# EasyEDA Pro project ProPrj_智能车主控V5.0-20251108_2026-08-26.epro, board PCB1
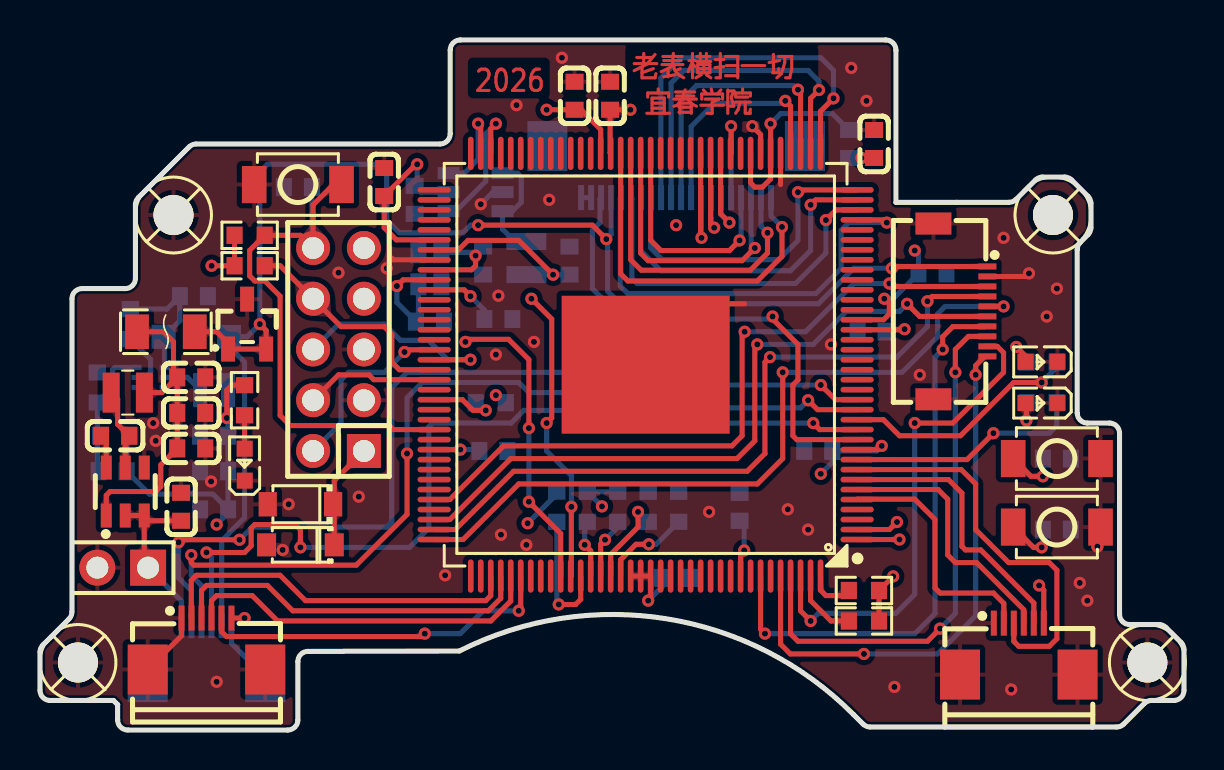
[diagram p13: board, top side]
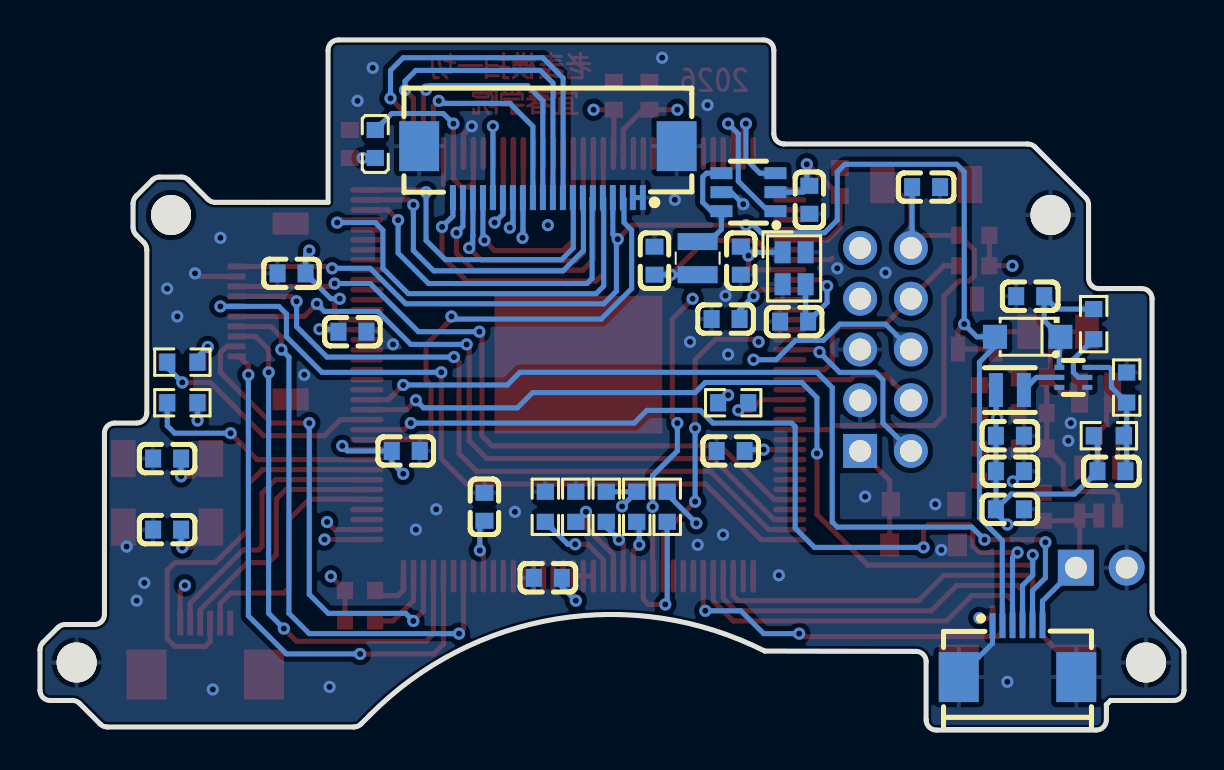
[diagram p14: board, bottom side, seen from below]

Outline 57.24 x 34.54 mm; copper layers: Top Layer, Inner1, Inner2, Bottom Layer. Coordinates in mm from the lower left corner of the outline.
Outline path: 0,3.9 arc(0.04,4.09) 0.15,4.26 1.45,5.56 arc(1.56,5.72) 1.6,5.92 1.6,21.59 arc(1.75,21.95) 2.11,22.1 4.27,22.1 arc(4.63,22.25) 4.78,22.61 4.78,26.29 arc(4.81,26.49) 4.92,26.65 7.46,29.19 arc(7.62,29.3) 7.82,29.34 20.02,29.34 arc(20.37,29.49) 20.52,29.84 20.52,34.04 arc(20.67,34.4) 21.03,34.54 42.32,34.54 arc(42.67,34.4) 42.82,34.04 42.82,26.42 48.48,26.42 arc(48.67,26.45) 48.84,26.57 49.8,27.53 arc(49.97,27.64) 50.16,27.68 51.26,27.68 arc(51.45,27.64) 51.62,27.53 52.43,26.72 arc(52.54,26.55) 52.58,26.36 52.58,25.16 arc(52.54,24.96) 52.43,24.8 52.04,24.41 arc(51.93,24.24) 51.89,24.05 51.89,15.88 arc(52.04,15.52) 52.4,15.37 53.5,15.37 arc(53.86,15.22) 54.01,14.86 54.01,5.79 arc(54.16,5.43) 54.52,5.28 55.98,5.28 arc(56.17,5.24) 56.34,5.13 57.09,4.38 arc(57.2,4.22) 57.24,4.02 57.24,1.99 arc(57.09,1.63) 56.73,1.48 55.61,1.48 arc(55.42,1.44) 55.25,1.33 54.22,0.3 arc(54.06,0.19) 53.86,0.15 41.54,0.15 arc(41.34,0.19) 41.18,0.3 40.72,0.76 arc(31.37,5.57) 20.98,3.95 13.41,3.94 arc(13.05,3.79) 12.9,3.43 12.9,0.51 arc(12.75,0.15) 12.4,0 4.39,0 arc(4.03,0.15) 3.89,0.51 3.89,1.27 3.68,1.48 0.51,1.48 arc(0.15,1.63) 0,1.99 0,3.9
Stack: Top Layer 0.035mm Outer layer thickness 1oz / Dielectric1 0.2104mm 7628 RC49% 8.6mil / Inner1 0.0152mm Inner layer thickness / Dielectric2 1.065mm 1.1mm H/HOZ Copper / Inner2 0.0152mm Inner layer thickness / Dielectric3 0.2104mm 7628 RC49% 8.6mil / Bottom Layer 0.035mm Outer layer thickness 1oz

## Design rules (mm)
spacing copperThickness1oz (default): track to track 0.102, other pairs 0.152 to 0.3
spacing copperThickness2oz: track to track 0.203, other pairs 0.152 to 0.3
track width copperThickness1oz (default): min 0.127, default 0.254, max 2.54
track width copperThickness2oz: min 0.203, default 0.254, max 2.54
differential pair differentialPair (default): width min 0.127, default 0.254, max 2.54; gap min 0.152, default 0.152
net VCC_3V3 uses copperRegion
net GND uses copperRegion

## Placement (name value [footprint] x y rotation side)
C1  10uF  [C0603]  7.06 11.18 270 top
C2  100nF  [C0603]  3.76 14.73 0 top
C3  100nF  [C0603]  7.57 17.65 180 top
C4  22uF  [C0603]  7.57 15.88 180 top
C5  22uF  [C0603]  7.57 14.1 180 top
C6  10uF  [C0603]  7.7 21.72 0 bottom
C7  22uF  [C0603]  8.71 14.73 0 bottom
C8  22uF  [C0603]  8.71 12.95 0 bottom
C9  100nF  [C0603]  8.71 11.05 0 bottom
C10  20pF  [C0603]  3.63 12.95 0 bottom
C11  22uF  [C0603]  18.75 26.54 90 bottom
C12  22uF  [C0603]  26.49 23.5 270 bottom
C13  12pF  [C0603]  22.17 23.5 90 bottom
C14  12pF  [C0603]  19.51 20.45 0 bottom
C15  100nF  [C0603]  12.9 27.18 0 bottom
C16  100nF  [C0603]  41.61 19.94 180 bottom
C17  100nF  [C0603]  38.94 13.97 180 bottom
C18  100nF  [C0603]  22.68 13.97 0 bottom
C19  100nF  [C0603]  28.52 31.75 90 top
C20  100nF  [C0603]  22.94 20.57 0 bottom
C21  100nF  [C0603]  17.22 27.43 90 top
C22  100nF  [C0603]  26.75 31.75 90 top
C23  100nF  [C0603]  31.83 7.62 0 bottom
C24  100nF  [C0603]  41.73 29.34 90 top
C25  100nF  [C0603]  35 11.18 90 bottom
C26  100nF  [C0603]  44.65 22.86 0 bottom
C27  100nF  [C0603]  50.88 10.03 180 bottom
C28  100nF  [C0603]  50.88 13.59 180 bottom
D1  SM05  [SOT-23-3_L2.9-W1.5-P1.90-LS2.6-BR]  10.36 20.32 270 top
D2  DSK34  [SOD-123FL_L2.7-W1.8-LS3.8-RD]  7.82 19.69 0 bottom
D4  SMF3.3A  [SOD-123_L2.8-W1.8-LS3.7-RD]  13.03 9.27 180 top
D5  BZT52C3V6  [SOD-123_L2.7-W1.6-LS3.7-RD]  13.03 11.3 180 top
F1  1206L200/24NR  [F1206]  6.3 19.94 0 top
FPC1  FPC-05F-6PH20  [FPC-SMD_6P-P0.50_XUNPU_FPC-05F-6PH20]  48.97 4.06 0 top
FPC2  FPC-05F-20PH20  [FPC-SMD_20P-P0.50_XUNPU_FPC-05F-20PH20]  31.83 27.94 0 bottom
FPC3  FPC-05F-6PH20  [FPC-SMD_6P-P0.50_XUNPU_FPC-05F-6PH20]  8.33 4.32 0 top
FPC4  FPC-05F-10PH15  [FPC-SMD_10P-P0.50_XUNPU_FPC-05F-10PH15]  46.05 20.96 270 top
FPC5  FPC-05F-6PH20  [FPC-SMD_6P-P0.50_XUNPU_FPC-05F-6PH20]  8.33 3.94 180 bottom
H1  PZ254V-12-10P  [HDR-TH_10P-P2.54-V-M-R2-C5-S2.54]  14.94 19.05 90 top
L1  4.7uH  [IND-SMD_L2.5-W2.0-VLS252012CX-150M]  24.33 23.62 270 bottom
L2  4.7uH  [IND-SMD_L2.5-W2.0-VLS252012CX-150M]  4.39 16.89 180 top
L3  BLM18EG221SN1D  [L0603]  40.46 29.34 90 bottom
LED1  -  [LED_0603]  10.24 13.34 90 top
LED2  -  [LED_0603]  50.05 16.37 180 top
LED3  -  [LED_0603]  50.05 18.43 180 top
Q1  AP2003  [SOT-23-6_L2.9-W1.6-P0.95-LS2.8-BR]  21.79 26.92 180 bottom
R1  10K  [R0603]  10.24 16.51 90 top
R2  45.3kΩ  [R0603]  3.76 14.73 0 bottom
R3  10K  [R0603]  2.87 17.15 270 bottom
R4  10K  [R0603]  4.52 20.32 90 bottom
R5  47K  [R0603]  28.91 11.18 90 bottom
R6  10K  [R0603]  10.49 23.24 180 top
R7  10K  [R0603]  22.56 16.38 0 bottom
R8  47K  [R0603]  41.22 6.98 0 top
R9  47K  [R0603]  41.22 5.46 0 top
R10  47K  [R0603]  27.38 11.18 90 bottom
R11  47K  [R0603]  25.86 11.18 90 bottom
R12  47K  [R0603]  31.95 11.18 90 bottom
R13  47K  [R0603]  30.43 11.18 90 bottom
R14  10K  [R0603]  10.49 24.77 0 top
R15  1K  [R0603]  50.11 16.38 180 bottom
R16  1K  [R0603]  50.11 18.42 180 bottom
SCREW1  -  [M2螺丝]  6.68 25.78 0 top
SCREW2  -  [M2螺丝]  50.68 25.78 0 top
SCREW3  -  [M2螺丝]  1.9 3.38 0 top
SCREW4  -  [M2螺丝]  55.4 3.38 180 top
SW1  TS-1088-AR02016  [SW-SMD_L3.9-W3.0-P4.45]  12.9 27.31 180 top
SW2  TS-1088-AR02016  [SW-SMD_L3.9-W3.0-P4.45]  50.88 10.16 0 top
SW3  TS-1088-AR02016  [SW-SMD_L3.9-W3.0-P4.45]  50.88 13.59 0 top
U1  SAK-TC264DA-40F200W BC  [LQFP-144_L20.0-W20.0-P0.50-LS22.0-BL-EP-1]  30.3 18.29 90 top
U2  2.2uH  [IND-SMD_L2.0-W1.6-B]  8.71 17.02 0 bottom
U3  TPS564242DRLR  [SOT-5X3-6_W1.6-L1.2-P0.50-LS1.6-BL]  5.54 17.65 270 bottom
U4  AP63205WU-7  [TSOT-23-6_L2.9-W1.6-P0.95-LS2.8-BL]  4.27 11.94 0 top
U5  20MHz  [CRYSTAL-SMD_4P-L2.0-W1.6-BL-2]  19.51 23.11 270 bottom
U6  HX PZ2.54-1x2P ZZ  [HDR-TH_2P-P2.54-V-M-3]  4.14 8.13 180 top

## Footprints (pads in the part's own frame, mm; a bottom-side part is the same pattern mirrored in y, then rotated)
C0603
  rect 0.8x0.9 smd: 1(-0.7,0) 2(0.7,0)
CRYSTAL-SMD_4P-L2.0-W1.6-BL-2
  rect 1.1x0.8 smd: 1(-0.8,-0.575) 2(0.8,-0.575) 3(0.8,0.575) 4(-0.8,0.575)
F1206
  rect 1.19x1.728 smd: 1(-1.445,0) 2(1.445,0)
FPC-SMD_6P-P0.50_XUNPU_FPC-05F-6PH20
  rect 0.3x1.25 smd: 1(-1.25,1.288) 2(-0.75,1.288) 3(-0.25,1.288) 4(0.25,1.288) 5(0.75,1.288) 6(1.25,1.288)
  rect 2x2.5 smd: 7(2.94,-1.288) 8(-2.94,-1.288)
FPC-SMD_10P-P0.50_XUNPU_FPC-05F-10PH15
  rect 0.3x0.9 smd: 1(-2.25,1.35) 2(-1.75,1.35) 3(-1.25,1.35) 4(-0.75,1.35) 5(-0.25,1.35) 6(0.25,1.35) 7(0.75,1.35) 8(1.25,1.35) 9(1.75,1.35) 10(2.25,1.35)
  rect 1.1x1.8 smd: 11(4.4,-1.35) 12(-4.4,-1.35)
FPC-SMD_20P-P0.50_XUNPU_FPC-05F-20PH20
  rect 0.3x1.25 smd: 1(-4.75,1.288) 2(-4.25,1.288) 3(-3.75,1.288) 4(-3.25,1.288) 5(-2.75,1.288) 6(-2.25,1.288) 7(-1.75,1.288) 8(-1.25,1.288) 9(-0.75,1.288) 10(-0.25,1.288) 11(0.25,1.288) 12(0.75,1.288) 13(1.25,1.288) 14(1.75,1.288) 15(2.25,1.288) 16(2.75,1.288) 17(3.25,1.288) 18(3.75,1.288) 19(4.25,1.288) 20(4.75,1.288)
  rect 2x2.5 smd: 21(6.44,-1.288) 22(-6.44,-1.288)
HDR-TH_2P-P2.54-V-M-3
  rect 1.8x1.8 hole 1.1: 1(-1.27,0)
  round 1.8 hole 1.1: 2(1.27,0)
HDR-TH_10P-P2.54-V-M-R2-C5-S2.54
  rect 1.7x1.7 hole 1.1: 1(-5.08,-1.27)
  round 1.7 hole 1.1: 2(-5.08,1.27) 3(-2.54,-1.27) 4(-2.54,1.27) 5(0,-1.27) 6(0,1.27) 7(2.54,-1.27) 8(2.54,1.27) 9(5.08,-1.27) 10(5.08,1.27)
IND-SMD_L2.0-W1.6-B
  rect 0.7x1.7 smd: 1(-0.7,0) 2(0.7,0)
IND-SMD_L2.5-W2.0-VLS252012CX-150M
  rect 0.85x2 smd: 1(-0.83,0) 2(0.83,0)
L0603
  rect 0.8x0.864 smd: 1(-0.7,0) 2(0.7,0)
LED_0603
  rect 0.8x0.8 smd: 1(-0.851,-0.01) 2(0.75,-0.005)
LQFP-144_L20.0-W20.0-P0.50-LS22.0-BL-EP-1
  oval 0.28x1.66 smd: 1(-8.75,-10.58) 2(-8.25,-10.58) 3(-7.75,-10.58) 4(-7.25,-10.58) 5(-6.75,-10.58) 6(-6.25,-10.58) 7(-5.75,-10.58) 8(-5.25,-10.58) 9(-4.75,-10.58) 10(-4.25,-10.58) 11(-3.75,-10.58) 12(-3.25,-10.58) 13(-2.75,-10.58) 14(-2.25,-10.58) 15(-1.75,-10.58) 16(-1.25,-10.58) 17(-0.75,-10.58) 18(-0.25,-10.58) 19(0.25,-10.58) 20(0.75,-10.58) 21(1.25,-10.58) 22(1.75,-10.58) 23(2.25,-10.58) 24(2.75,-10.58) 25(3.25,-10.58) 26(3.75,-10.58) 27(4.25,-10.58) 28(4.75,-10.58) 29(5.25,-10.58) 30(5.75,-10.58) 31(6.25,-10.58) 32(6.75,-10.58) 33(7.25,-10.58) 34(7.75,-10.58) 35(8.25,-10.58) 36(8.75,-10.58) 73(8.75,10.58) 74(8.25,10.58) 75(7.75,10.58) 76(7.25,10.58) 77(6.75,10.58) 78(6.25,10.58) 79(5.75,10.58) 80(5.25,10.58) 81(4.75,10.58) 82(4.25,10.58) 83(3.75,10.58) 84(3.25,10.58) 85(2.75,10.58) 86(2.25,10.58) 87(1.75,10.58) 88(1.25,10.58) 89(0.75,10.58) 90(0.25,10.58) 91(-0.25,10.58) 92(-0.75,10.58) 93(-1.25,10.58) 94(-1.75,10.58) 95(-2.25,10.58) 96(-2.75,10.58) 97(-3.25,10.58) 98(-3.75,10.58) 99(-4.25,10.58) 100(-4.75,10.58) 101(-5.25,10.58) 102(-5.75,10.58) 103(-6.25,10.58) 104(-6.75,10.58) 105(-7.25,10.58) 106(-7.75,10.58) 107(-8.25,10.58) 108(-8.75,10.58)
  oval 1.66x0.28 smd: 37(10.58,-8.75) 38(10.58,-8.25) 39(10.58,-7.75) 40(10.58,-7.25) 41(10.58,-6.75) 42(10.58,-6.25) 43(10.58,-5.75) 44(10.58,-5.25) 45(10.58,-4.75) 46(10.58,-4.25) 47(10.58,-3.75) 48(10.58,-3.25) 49(10.58,-2.75) 50(10.58,-2.25) 51(10.58,-1.75) 52(10.58,-1.25) 53(10.58,-0.75) 54(10.58,-0.25) 55(10.58,0.25) 56(10.58,0.75) 57(10.58,1.25) 58(10.58,1.75) 59(10.58,2.25) 60(10.58,2.75) 61(10.58,3.25) 62(10.58,3.75) 63(10.58,4.25) 64(10.58,4.75) 65(10.58,5.25) 66(10.58,5.75) 67(10.58,6.25) 68(10.58,6.75) 69(10.58,7.25) 70(10.58,7.75) 71(10.58,8.25) 72(10.58,8.75) 109(-10.58,8.75) 110(-10.58,8.25) 111(-10.58,7.75) 112(-10.58,7.25) 113(-10.58,6.75) 114(-10.58,6.25) 115(-10.58,5.75) 116(-10.58,5.25) 117(-10.58,4.75) 118(-10.58,4.25) 119(-10.58,3.75) 120(-10.58,3.25) 121(-10.58,2.75) 122(-10.58,2.25) 123(-10.58,1.75) 124(-10.58,1.25) 125(-10.58,0.75) 126(-10.58,0.25) 127(-10.58,-0.25) 128(-10.58,-0.75) 129(-10.58,-1.25) 130(-10.58,-1.75) 131(-10.58,-2.25) 132(-10.58,-2.75) 133(-10.58,-3.25) 134(-10.58,-3.75) 135(-10.58,-4.25) 136(-10.58,-4.75) 137(-10.58,-5.25) 138(-10.58,-5.75) 139(-10.58,-6.25) 140(-10.58,-6.75) 141(-10.58,-7.25) 142(-10.58,-7.75) 143(-10.58,-8.25) 144(-10.58,-8.75)
  rect 6.9x8.4 smd: 145(0,0)
M2螺丝
  round 2 hole 2: 1(0,0)
R0603
  rect 0.806x0.864 smd: 1(-0.753,0) 2(0.753,0)
SOD-123_L2.7-W1.6-LS3.7-RD
  rect 0.91x1.22 smd: 1(-1.635,0) 2(1.635,0)
SOD-123_L2.8-W1.8-LS3.7-RD
  rect 0.95x1.15 smd: 1(-1.692,0) 2(1.692,0)
SOD-123FL_L2.7-W1.8-LS3.8-RD
  rect 1.2x1.2 smd: 1(-1.635,0) 2(1.635,0)
SOT-5X3-6_W1.6-L1.2-P0.50-LS1.6-BL
  rect 0.25x0.5 smd: 1(-0.501,-0.7) 2(-0.001,-0.7) 3(0.499,-0.7) 4(0.501,0.7) 5(-0.001,0.7) 6(-0.501,0.7)
SOT-23-3_L2.9-W1.5-P1.90-LS2.6-BR
  rect 1.25x0.7 smd: 1(1.25,-0.95) 2(1.25,0.95) 3(-1.25,0)
SOT-23-6_L2.9-W1.6-P0.95-LS2.8-BR
  rect 1.1x0.6 smd: 1(1.35,-0.95) 2(1.35,0) 3(1.35,0.95) 4(-1.35,0.95) 5(-1.35,0) 6(-1.35,-0.95)
SW-SMD_L3.9-W3.0-P4.45
  rect 1.23x1.86 smd: 1(-2.185,0) 2(2.185,0)
TSOT-23-6_L2.9-W1.6-P0.95-LS2.8-BL
  rect 0.55x1.2 smd: 1(-0.95,-1.2) 2(0,-1.2) 3(0.95,-1.2) 4(0.95,1.2) 5(0,1.2) 6(-0.95,1.2)

## Nets
As in the schematic, except:
GND: C1.1 C3.1 C4.1 C5.1 C6.2 C7.1 C8.1 C9.1 C11.1 C12.1 C13.1 C14.2 C15.1 C16.2 C17.2 C18.2 C19.2 C20.2 C21.2 C22.2 C23.2 C24.2 C25.2 C26.2 C27.1 C28.1 D1.3 D4.2 D5.2 FPC1.1 FPC1.7 FPC1.8 FPC2.1 FPC2.2 FPC2.21 FPC2.22 FPC3.1 FPC3.7 FPC3.8 FPC4.2 FPC4.11 FPC4.12 FPC5.1 FPC5.7 FPC5.8 H1.3 H1.5 LED1.1 LED2.1 LED3.1 Q1.5 R3.1 R12.2 R13.2 SCREW1.1 SCREW3.1 SCREW4.1 SW1.2 SW2.2 SW3.2 U1.41 U1.43 U1.80 U1.145 U3.3 U3.4 U4.4 U5.2 U5.4 U6.2

Pads without a net: SCREW2 1; U1 3 4 16 17 18 19 20 21 24 25 26 27 28 29 30 31 32 45 50 51 52 53 60 61 62 63 64 65 66 67 68 69 72 73 74 75 76 77 84 85 86 87 88 93 95 96 98 100 101 102 103 105 109 110 115 116 117 128 129 130 131 132 133 134 135 137 139

## Via types
v1: diameter 0.61, hole 0.305, Top Layer to Bottom Layer, 135 vias

## Routing (per net, layer and track width the routed paths; a pad name or vN(x,y) marks a point on that pad's centre or on a via; arc(x,y) is an arc through that point)
GND: length 22
  Top Layer w0.254: U1.41 37.05,27.31 ; v1(35.64,30.23) 36.05,29.81 U1.43 ; 35.25,21.34 33.35,21.34 U1.145 ; FPC3.1 7.08,4.72 FPC3.8 ; 17.6,23.62 17.69,23.54 U1.80 ; v1(49.48,22.86) 49.32,22.71 FPC4.2
  Bottom Layer w0.254: Q1.5 22.65,26.92 v1(22.05,26.32) ; FPC5.1 9.58,4.34 FPC5.8 ; FPC2.2 FPC2.1
  vias: v1(5.66,15.37) v1(5.79,14.48) v1(8.56,12.44) v1(8.84,2.41) v1(12.14,9.02) v1(12.44,11.3) v1(14.94,22.89) v1(15.95,11.68) v1(17.35,23.11) v1(20.27,7.75) v1(22.81,18.8) v1(22.94,21.74) v1(23.06,9.78) v1(23.84,31.28) v1(24.33,9.27) v1(24.71,19.43) v1(25.48,26.54) v1(26.11,33.66) v1(33.48,10.92) v1(37.41,11.05) v1(38.43,10.03) v1(39.57,19.3) v1(40.59,33.15) v1(41.35,31.5) v1(42.75,2.16) v1(44.02,17.78) v1(48.21,24.64) v1(48.59,2.03) v1(50.37,20.7) v1(50.88,22.1) v1(52.02,7.37) v1(52.4,6.48) v1(52.9,9.18)
VCC_1V3: length 73.6
  Top Layer w0.254: U1.58 28.52,28.9 C19.1 v1(29.54,31.05) ; U1.22 43.23,20.04 v1(43.26,20.07) ; U1.10 41.93,14.04 v1(42.11,14.22) ; U1.79 20.94,24.04 21.41,24.51 23.95,24.51 v1(25.67,22.79) ; U1.99 v1(21.03,14.04)
  Inner2 w0.254: 29.55,22.79 v1(25.67,22.79) 25.67,16.96 25.48,16.76 23.7,16.76 23.32,16.38 23.32,14.48 22.94,14.1 21.09,14.1 v1(21.03,14.04) ; 29.55,22.79 29.54,22.8 v1(29.54,31.05) ; 29.55,22.79 41.04,22.79 41.48,22.35 41.48,19.94 41.66,19.76 42.95,19.76 v1(43.26,20.07) 43.26,17.02 v1(39.06,12.83)
  Bottom Layer w0.254: v1(21.03,14.04) 21.91,14.04 C18.1 ; L1.2 v1(25.67,22.79) 26.49,22.79 C12.2 ; C16.1 42.43,20.07 v1(43.26,20.07) ; v1(39.06,12.83) 39.64,13.4 C17.1 41.86,13.97 v1(42.11,14.22)
VCC_3V3: length 66.8
  Top Layer w0.254: v1(49.99,7.24) 50.22,7.01 FPC1.6 ; U1.78 17.83,24.54 17.22,25.15 C21.1 18.81,28.32 v1(18.87,28.32) ; R1.2 9.59,17.26 9.35,17.02 v1(9.35,15.62) ; v1(21.54,21.72) 21.22,22.04 U1.83 ; FPC3.6 v1(10.24,5.61) ; v1(8.59,23.24) R6.2 R14.1 ; v1(42.69,7.69) R8.2 R9.2 ; U1.136 35.05,8.81 v1(35.23,8.99) ; v1(30.43,6.48) 30.55,6.6 U1.127 U1.126 U1.125 ; v1(25.35,31.05) C22.1 27.06,31.05 28.05,30.06 U1.59 ; v1(42.24,21.59) 42.49,21.34 42.49,20.83 42.2,20.54 U1.23 ; 41.61,28.64 v1(41.1,28.64) ; H1.1 14.72,12.49 D4.1
  Bottom Layer w0.254: v1(30.43,6.48) 31.13,7.17 C23.1 ; R7.2 22.93,16.76 v1(22.81,16.76) ; C20.1 22.24,21.02 v1(21.54,21.72) ; v1(18.87,28.32) 18.87,27.37 C11.2 19.06,26.92 Q1.2 ; R5.2 R10.2 v1(28.12,11.2) ; C9.2 9.41,10.86 v1(8.84,10.29) ; C9.2 C8.2 C7.2 U2.2 ; C9.2 8.65,11.81 5.47,11.81 C10.2 4.33,14.55 R2.2 ; v1(43.76,24) 43.95,23.81 43.95,22.86 42.68,21.59 v1(42.24,21.59) ; C25.1 35.23,10.25 v1(35.23,8.99) ; R11.2 25.86,11.81 v1(24.4,10.35) ; L3.1 v1(41.1,28.64)
  vias: v1(31.83,25.27)
VCC_5V: length 75.7
  Top Layer w0.254: F1.2 8.84,19.94 9.41,19.37 D1.1 D1.2 11.31,20.01 v1(11,20.32) ; v1(21.92,25.27) 27.64,25.27 v1(28.33,24.57) ; v1(42.62,23.11) 42.71,23.21 47.27,23.21
  Bottom Layer w0.254: FPC5.2 9.09,5.24 9.09,9.49 10.24,10.63 10.24,18.42 9.46,19.19 D2.2 10.36,19.69 v1(11,20.32) 11,27.94 11.38,28.32 16.97,28.32 17.35,27.94 17.35,25.53 17.98,24.89 21.16,24.89 21.54,25.27 v1(21.92,25.27) ; v1(42.62,23.11) 40.72,23.11 38.94,21.34 29.03,21.34 28.4,21.97 28.4,24.51 v1(28.33,24.57) 28.58,24.82 FPC2.4
VIN: length 9.2
  Top Layer w0.254: U6.1 5.22,8.32 U4.3 ; U4.3 5.48,10.48 C1.2 ; U4.3 U4.2
  Bottom Layer w0.254: U6.1 7.08,6.46 FPC5.6
ADC1: length 17.9
  Top Layer w0.254: U1.57 29.05,22.84 29.41,22.48 35.89,22.48 37.12,23.71 v1(37.12,25.18)
  Bottom Layer w0.254: FPC2.20 36.58,25.73 v1(37.12,25.18)
ADC2: length 15.7
  Top Layer w0.254: v1(36.4,24.89) 36.4,23.88 35.54,23.02 30.08,23.02 29.55,23.55 U1.56
  Bottom Layer w0.254: v1(36.4,24.89) 36.08,25.21 FPC2.19
ADC3: length 13.7
  Top Layer w0.254: U1.55 30.05,23.87 30.43,23.5 35.13,23.5 v1(35.76,24.13)
  Bottom Layer w0.254: v1(35.76,24.13) 35.59,24.31 35.59,24.75 35.58,24.76 FPC2.18
ADC4: length 11.4
  Top Layer w0.254: U1.54 30.55,24.52 31.06,24 34.49,24 v1(35,24.51)
  Bottom Layer w0.254: FPC2.17 35.08,24.59 v1(35,24.51)
ADC5: length 4.9
  Top Layer w0.254: v1(34.58,30.23) 34.58,28.89 U1.46
  Bottom Layer w0.254: FPC2.16 v1(34.58,30.23)
ADC6: length 5.1
  Top Layer w0.254: U1.47 34.05,25.84 v1(34.49,25.4)
  Bottom Layer w0.254: v1(34.49,25.4) 34.08,25.82 FPC2.15
ADC7: length 5.4
  Top Layer w0.254: U1.48 33.55,25.33 v1(33.73,25.15)
  Bottom Layer w0.254: v1(33.73,25.15) 33.58,25.3 FPC2.14
ADC8: length 6.3
  Top Layer w0.254: U1.49 33.05,24.68 v1(33.1,24.64)
  Bottom Layer w0.254: v1(33.1,24.64) 33.08,24.66 FPC2.13
ADC9: length 11.5
  Top Layer w0.254: U1.40 37.55,31.23 v1(37.29,31.5)
  Bottom Layer w0.254: v1(37.29,31.5) 37.16,31.37 33.73,31.37 32.58,30.21 FPC2.12
ADC10: length 14.3
  Top Layer w0.254: v1(37.92,32.05) 38.05,31.92 U1.39
  Bottom Layer w0.254: v1(37.92,32.05) 37.72,32.26 32.84,32.26 32.08,31.5 32.08,26.66 FPC2.11
ADC11: length 17.4
  Top Layer w0.254: U1.38 38.55,31.62 v1(38.97,32.04)
  Bottom Layer w0.254: v1(38.97,32.04) 38.97,32.48 38.43,33.02 32.21,33.02 31.57,32.39 31.57,26.66 FPC2.10
ADC12: length 19.7
  Top Layer w0.254: U1.37 39.05,30.98 v1(39.7,31.62)
  Bottom Layer w0.254: v1(39.7,31.62) 39.7,33.02 39.06,33.66 32.08,33.66 31.06,32.64 31.06,26.66 FPC2.9
ADC13: length 16
  Top Layer w0.254: v1(37.92,26.92) 38.04,27.04 U1.36
  Bottom Layer w0.254: v1(37.92,26.92) 37.92,24.51 36.96,23.55 31.14,23.55 30.56,24.13 30.56,26.63 FPC2.8
ADC14: length 16.7
  Top Layer w0.254: v1(38.56,26.29) 38.81,26.54 U1.35
  Bottom Layer w0.254: v1(38.56,26.29) 38.56,24 37.54,22.99 31.06,22.99 30.05,24 30.05,26.62 FPC2.7
ADC15: length 17.9
  Top Layer w0.254: v1(39.32,25.53) 39.83,26.04 U1.34
  Bottom Layer w0.254: v1(39.32,25.53) 39.32,23.88 37.8,22.35 29.87,22.35 29.61,22.61 29.61,26.61 FPC2.6
ADC16: length 22.1
  Top Layer w0.254: U1.33 42.23,25.54 v1(42.37,25.4)
  Bottom Layer w0.254: v1(42.37,25.4) 40.46,25.4 40.08,25.02 40.08,23.11 38.81,21.84 29.41,21.84 29.03,22.23 29.03,26.61 FPC2.5
ARX0: length 25.4
  Top Layer w0.254: v1(25.35,15.37) 25.6,15.62 25.6,20.57 v1(24.59,21.59) ; U1.119 26.59,7.74 v1(26.59,11.17)
  Inner2 w0.254: v1(24.59,21.59) 24.59,22.99 23.19,24.38 16.46,24.38 H1.9
  Bottom Layer w0.254: v1(25.35,15.37) 25.35,13.97 26.59,12.73 v1(26.59,11.17)
ATX0: length 21.1
  Top Layer w0.254: v1(24.46,15.11) 24.46,18.54 23.44,19.56 21.41,19.56 v1(21.28,19.43) ; U1.118 26.05,9.84 v1(24.46,11.43)
  Inner2 w0.254: v1(21.28,19.43) 18.62,19.43 16.46,21.59 16.21,21.59
  Bottom Layer w0.254: v1(24.46,11.43) v1(24.46,15.11)
EC_CLK1: length 18.4
  Top Layer w0.254: FPC3.3 8.08,6.98 8.34,7.24 11.38,7.24 12.65,5.97 22.43,5.97 23.05,6.59 U1.112
EC_CLK2: length 20.2
  Top Layer w0.254: FPC1.3 48.72,4.44 48.97,4.19 50.5,4.19 50.88,4.57 50.88,8 50.5,8.38 48.46,8.38 46.81,10.03 46.81,12.32 46.09,13.04 U1.8
EC_CS1: length 18.6
  Top Layer w0.254: U1.111 22.55,6.73 22.3,6.48 13.28,6.48 12.01,7.75 7.82,7.75 7.57,7.49 7.57,5.62 FPC3.2
EC_CS2: length 12.5
  Top Layer w0.254: FPC1.2 48.22,6.34 47.7,6.86 45.03,6.86 44.78,7.11 44.78,10.54 43.76,11.56 40.9,11.56 U1.5
EC_MISO1: length 18.1
  Top Layer w0.254: U1.113 23.55,6.46 22.56,5.46 11.89,5.46 10.62,6.73 8.84,6.73 8.58,6.47 FPC3.4
EC_MISO2: length 13.1
  Top Layer w0.254: FPC1.4 49.22,6.02 46.86,8.38 45.8,8.38 45.42,8.76 45.42,11.56 44.93,12.04 U1.6
EC_MOSI1: length 18
  Top Layer w0.254: v1(19.25,4.83) 19.11,4.68 9.34,4.68 9.08,4.93 FPC3.5 ; U1.114 24.05,6.07 v1(23.95,5.97)
  Bottom Layer w0.254: v1(23.95,5.97) 22.17,5.97 21.03,4.83 v1(19.25,4.83)
EC_MOSI2: length 14
  Top Layer w0.254: FPC1.5 49.72,6.36 47.07,9.02 46.3,9.02 46.12,9.2 46.12,11.86 45.45,12.54 U1.7
EM1_PWM: length 44.6
  Top Layer w0.254: v1(13.03,9.14) 13.03,10.03 12.78,10.29 10.74,10.29 10.57,10.11 10.57,9.22 10.24,8.89 v1(8.33,8.89) ; U1.12 39.01,15.04 v1(38.68,15.37)
  Bottom Layer w0.254: v1(13.03,9.14) 18.49,9.14 19.45,10.11 19.45,15.19 19.63,15.37 23.57,15.37 24.21,16 26.87,16 27.51,15.37 v1(38.68,15.37) ; FPC5.3 8.58,8.64 v1(8.33,8.89)
EM2_PWM: length 45.6
  Top Layer w0.254: v1(18.36,13.84) 18.36,10.8 15.82,8.26 7.7,8.26 7.57,8.38 v1(7.57,8.76) ; U1.14 38.9,16.04 v1(38.43,16.51)
  Bottom Layer w0.254: FPC5.4 8.08,7.23 7.57,7.75 v1(7.57,8.76) ; v1(18.36,13.84) 18.36,16.64 19.13,17.4 23.95,17.4 24.46,16.89 32.59,16.89 33.35,16.13 38.05,16.13 v1(38.43,16.51)
EM3_PWM: length 46.4
  Top Layer w0.254: v1(6.93,9.4) 7.06,9.53 v1(9.98,9.53) ; v1(39.06,17.27) 39.8,16.54 U1.15
  Bottom Layer w0.254: v1(9.98,9.53) 10.62,10.16 17.35,10.16 17.6,10.41 17.6,17.15 18.36,17.91 33.22,17.91 33.86,17.27 v1(39.06,17.27) ; v1(6.93,9.4) 6.93,7.62 7.58,6.97 FPC5.5
IMU_CS1: length 35.1
  Top Layer w0.254: v1(42.49,22.35) 42.64,22.21 47.27,22.21 ; U1.104 20.5,11.54 23.19,14.22 34.62,14.22 35.13,14.73 35.13,19.81 v1(35.25,19.94)
  Bottom Layer w0.254: v1(35.25,19.94) 38.3,19.94 40.72,22.35 v1(42.49,22.35)
IMU_CS2: length 28.2
  Top Layer w0.254: U1.138 36.05,5.05 v1(36.27,4.83) ; v1(45.16,19.05) 45.16,19.69 45.67,20.19 47.26,20.19 47.27,20.21
  Bottom Layer w0.254: v1(36.27,4.83) 43.76,4.83 44.78,5.84 44.78,18.67 v1(45.16,19.05)
IMU_MISO1: length 35
  Top Layer w0.254: 47.27,20.71 44.01,20.71 v1(43.38,21.34) ; U1.106 20.5,10.54 23.56,13.59 34.87,13.59 35.76,14.48 35.76,19.18 v1(35.89,19.3)
  Bottom Layer w0.254: v1(35.89,19.3) 38.68,19.3 40.34,20.96 43,20.96 v1(43.38,21.34)
IMU_MISO2: length 27.3
  Top Layer w0.254: v1(46.81,17.78) 46.81,18.24 47.27,18.71 ; U1.140 37.05,4.3 37.54,3.81 v1(41.22,3.81)
  Bottom Layer w0.254: v1(41.22,3.81) 44.91,3.81 46.81,5.72 v1(46.81,17.78)
IMU_MOSI1: length 37.5
  Top Layer w0.254: 47.27,21.21 v1(48.21,21.21) ; U1.108 21.17,9.54 23.95,12.32 35.89,12.32 37.16,13.59 v1(37.16,17.91)
  Bottom Layer w0.254: v1(37.16,17.91) 43.13,17.91 44.91,19.69 44.91,20.83 45.28,21.21 v1(48.21,21.21)
IMU_MOSI2: length 24.3
  Top Layer w0.254: v1(43.76,15.37) 45.67,15.37 48.21,17.91 48.21,18.89 47.89,19.21 47.27,19.21 ; v1(38.56,5.46) 38.05,5.97 U1.142
  Bottom Layer w0.254: v1(43.76,15.37) 43.76,6.79 42.82,5.84 38.94,5.84 v1(38.56,5.46)
IMU_SCL1: length 35.8
  Top Layer w0.254: v1(44.4,21.46) 44.64,21.71 47.27,21.71 ; v1(36.53,18.67) 36.27,18.42 36.27,13.84 35.38,12.95 23.7,12.95 20.78,10.04 U1.107
  Bottom Layer w0.254: v1(44.4,21.46) 44.4,20.19 42.88,18.67 v1(36.53,18.67)
IMU_SCL2: length 26.8
  Top Layer w0.254: v1(45.03,5.08) 44.4,4.45 37.92,4.45 37.55,4.82 U1.141 ; 47.27,19.71 46.45,19.71 45.8,19.05 v1(45.8,17.91)
  Bottom Layer w0.254: v1(45.03,5.08) 45.8,5.84 v1(45.8,17.91)
KEY1: length 12.2
  Top Layer w0.254: v1(50.11,9.14) 49.71,9.14 SW2.1 ; U1.1 v1(43,9.54)
  Inner2 w0.254: v1(43,9.54) 49.72,9.54 v1(50.11,9.14)
  Bottom Layer w0.254: C27.2 50.18,9.21 v1(50.11,9.14)
KEY2: length 13.1
  Top Layer w0.254: SW3.1 49.58,12.7 v1(50.18,12.7) ; U1.2 42.5,10.04 v1(42.88,10.41)
  Inner2 w0.254: v1(42.88,10.41) 47.89,10.41 v1(50.18,12.7)
  Bottom Layer w0.254: C28.2 v1(50.18,12.7)
LED1: length 11.8
  Top Layer w0.254: v1(47.7,14.86) 46.38,13.54 U1.9
  Bottom Layer w0.254: R15.1 50.87,15.23 50.5,14.86 v1(47.7,14.86)
LED2: length 12
  Top Layer w0.254: U1.13 42.2,15.54 43,14.73 46.05,14.73 48.72,17.4 v1(50.11,17.4)
  Bottom Layer w0.254: R16.1 50.87,18.15 v1(50.11,17.4)
P00.0: length 24.3
  Top Layer w0.254: v1(36.65,20.7) 36.65,20.57 37.92,19.3 37.92,17.53 37.67,17.27 37.67,14.73 37.86,14.54 U1.11
  Bottom Layer w0.254: FPC2.3 28.02,26.59 28.02,25.4 27.64,25.02 27.64,22.1 29.16,20.57 36.53,20.57 v1(36.65,20.7)
P10.5: length 3.6
  Top Layer w0.254: R9.1 39.57,5.46 38.55,6.48 U1.143
P10.6: length 2.3
  Top Layer w0.254: U1.144 39.05,7 39.32,6.73 40.22,6.73 R8.1
P14.2: length 6.5
  Top Layer w0.254: U1.120 27.05,6.54 26.8,6.29 v1(25.95,6.29)
  Bottom Layer w0.254: v1(25.95,6.29) 25.86,6.38 R11.1
P14.3: length 2.9
  Top Layer w0.254: v1(27.25,9.27) 27.55,8.97 U1.121
  Bottom Layer w0.254: R10.1 27.25,10.3 v1(27.25,9.27)
P14.4: length 3.1
  Top Layer w0.254: U1.122 28.05,9.31 v1(28.27,9.53)
  Bottom Layer w0.254: v1(28.27,9.53) 28.91,10.16 R5.1
P14.5: length 3.8
  Top Layer w0.254: U1.123 28.55,8.79 29.92,10.16 v1(29.92,10.92)
P14.6: length 4.5
  Top Layer w0.254: v1(30.46,9.3) 29.82,9.3 29.05,8.53 U1.124
  Bottom Layer w0.254: v1(30.46,9.3) 30.83,9.3 R12.1
P20.2: length 3.5
  Top Layer w0.254: v1(22.3,16) 21.67,16 21.13,16.54 U1.94
  Bottom Layer w0.254: v1(22.3,16) 22.18,16 R7.1
RST: length 28
  Top Layer w0.254: U1.97 17.68,15.04 17.47,15.24 12.52,15.24 12.01,15.75 12.01,21.72 11.25,22.48 10.74,22.48 10.49,22.73 10.49,24.01 R14.2 13.03,24.77 H1.10 13.67,26.29 14.68,27.31 SW1.1
  Bottom Layer w0.254: C15.2 13.6,24.19 H1.10
TCK: length 6.7
  Top Layer w0.254: U1.92 16.7,17.54 16.46,17.78 14.94,17.78 H1.4
TDO: length 11
  Top Layer w0.254: U1.90 v1(21.54,18.54)
  Bottom Layer w0.254: H1.6 14.94,20.32 17.22,20.32 18.03,19.51 19.43,19.51 20.4,18.54 v1(21.54,18.54)
TMS: length 9.6
  Top Layer w0.254: v1(18.24,18.92) 18.35,19.04 U1.89
  Bottom Layer w0.254: H1.2 15.06,15.37 15.06,17.53 15.44,17.91 17.23,17.91 18.36,19.04
TRST: length 11.5
  Top Layer w0.254: R6.1 12.01,23.24 15.06,20.19 17.22,20.19 17.6,19.81 17.6,18.42 17.98,18.04 U1.91
VGATE1N: length 7.2
  Top Layer w0.254: U1.70 22.55,30.1 v1(22.81,30.35)
  Bottom Layer w0.254: Q1.1 20.5,26.04 20.86,26.04 22.3,27.47 22.3,29.84 v1(22.81,30.35)
VGATE1P: length 5.1
  Top Layer w0.254: U1.71 22.05,30.22 v1(21.92,30.35)
  Bottom Layer w0.254: v1(21.92,30.35) 21.92,28.58 21.22,27.87 Q1.3
XTAL1: length 5.5
  Top Layer w0.254: U1.81 21.59,23.04 21.79,23.24 v1(21.79,23.75)
  Bottom Layer w0.254: v1(21.79,23.75) 22.17,24.13 C13.2 21.89,23.91 U5.1
XTAL2: length 6.1
  Top Layer w0.254: v1(17.86,22.23) 18.17,22.54 U1.82
  Bottom Layer w0.254: U5.3 18.93,20.57 C14.1 17.86,21.4 v1(17.86,22.23)
$1N3: length 6.7
  Bottom Layer w0.254: U3.6 3.75,18.15 3.63,18.03 3.63,17.15 R3.2 2.87,13.02 C10.1
$1N4: length 2.9
  Bottom Layer w0.254: U3.5 5.28,17.65 5.54,17.91 5.54,18.55 R4.1
$1N9: length 2
  Bottom Layer w0.254: U3.2 7.38,17.65 U2.1
$1N11: length 6.7
  Bottom Layer w0.254: R4.2 6.35,21.07 C6.1 7,20.49 D2.1 6.24,19.64 U3.1
$1N15: length 1.7
  Top Layer w0.254: R1.1 10.24,14.09 LED1.2
$1N23: length 15.6
  Top Layer w0.254: 6.87,17.65 6.87,14.1 6.05,13.27 6.05,12.19 5.79,11.94 3.51,11.94 3.32,11.75 U4.1 ; 6.87,17.65 6.11,16.89 L2.1 ; 6.87,17.65 6.68,17.84 6.68,19.43 6.17,19.94 F1.1
$1N24: length 4.2
  Top Layer w0.254: L2.2 3.89,16.57 3.89,15.31 C2.2 4.27,14.54 U4.5
$1N25: length 1.7
  Top Layer w0.254: U4.6 3.32,14.47 3.06,14.73
$2N13: length 5.8
  Bottom Layer w0.254: 24.33,24.45 23.76,24.45 23.14,25.07 Q1.6 23.64,25.97 24.08,26.42 24.08,27.69 23.89,27.87 Q1.4
$2N36: length 10
  Top Layer w0.254: v1(36.55,30.35) U1.42 36.55,27.59 36.14,27.18 35.76,27.18 35.55,27.39 U1.44
  Bottom Layer w0.254: L3.2 39.64,30.86 37.06,30.86 v1(36.55,30.35)
$2N229: length 1.8
  Top Layer w0.254: 49.31,16.37 49.35,16.33 v1(49.35,15.49)
  Bottom Layer w0.254: R15.2 49.35,16.37 v1(49.35,15.49)
$2N232: length 1.9
  Top Layer w0.254: v1(48.84,19.18) 49.31,18.72 49.31,18.43
  Bottom Layer w0.254: v1(48.84,19.18) 49.36,18.66 R16.2

## Copper pours and planes (outline as drawn; the poured copper is in the pictures)
GND on Top Layer: -1.7,36.32 59.51,36.32 59.51,-3.43 -1.7,-3.43
GND on Bottom Layer: -1.45,35.69 58.24,35.69 58.24,-2.16 -1.45,-2.16
GND on Inner1: 0.26,34.29 56.98,34.29 56.98,0.26 0.26,0.26
VCC_3V3 on Inner2: -8.31,36.07 61.93,36.07 61.93,-2.67 -8.31,-2.67

Small or netless copper shapes (teardrops, artwork), in the pictures only: 225 on Top Layer, 162 on Bottom Layer, 22 on Inner1, 16 on Inner2

## Text on the board
Top Layer: 2026 | 老表横扫一切 | 宜春学院
